# EasyEDA Pro project ProPrj_胡博睿-8777947A-分贝检测仪_2025-12-19.epro

# Schematic 分贝检测仪_SCH
Board Name: 分贝检测仪; Create Date: 2025-08-09; Page Name: P1; Project Name: 胡博睿-8777947A-分贝检测仪; Schematic Name: 分贝检测仪_SCH; Update Date: 2025-08-09; Company: 嘉立创EDA; Page Size: A4; Version: V1.0
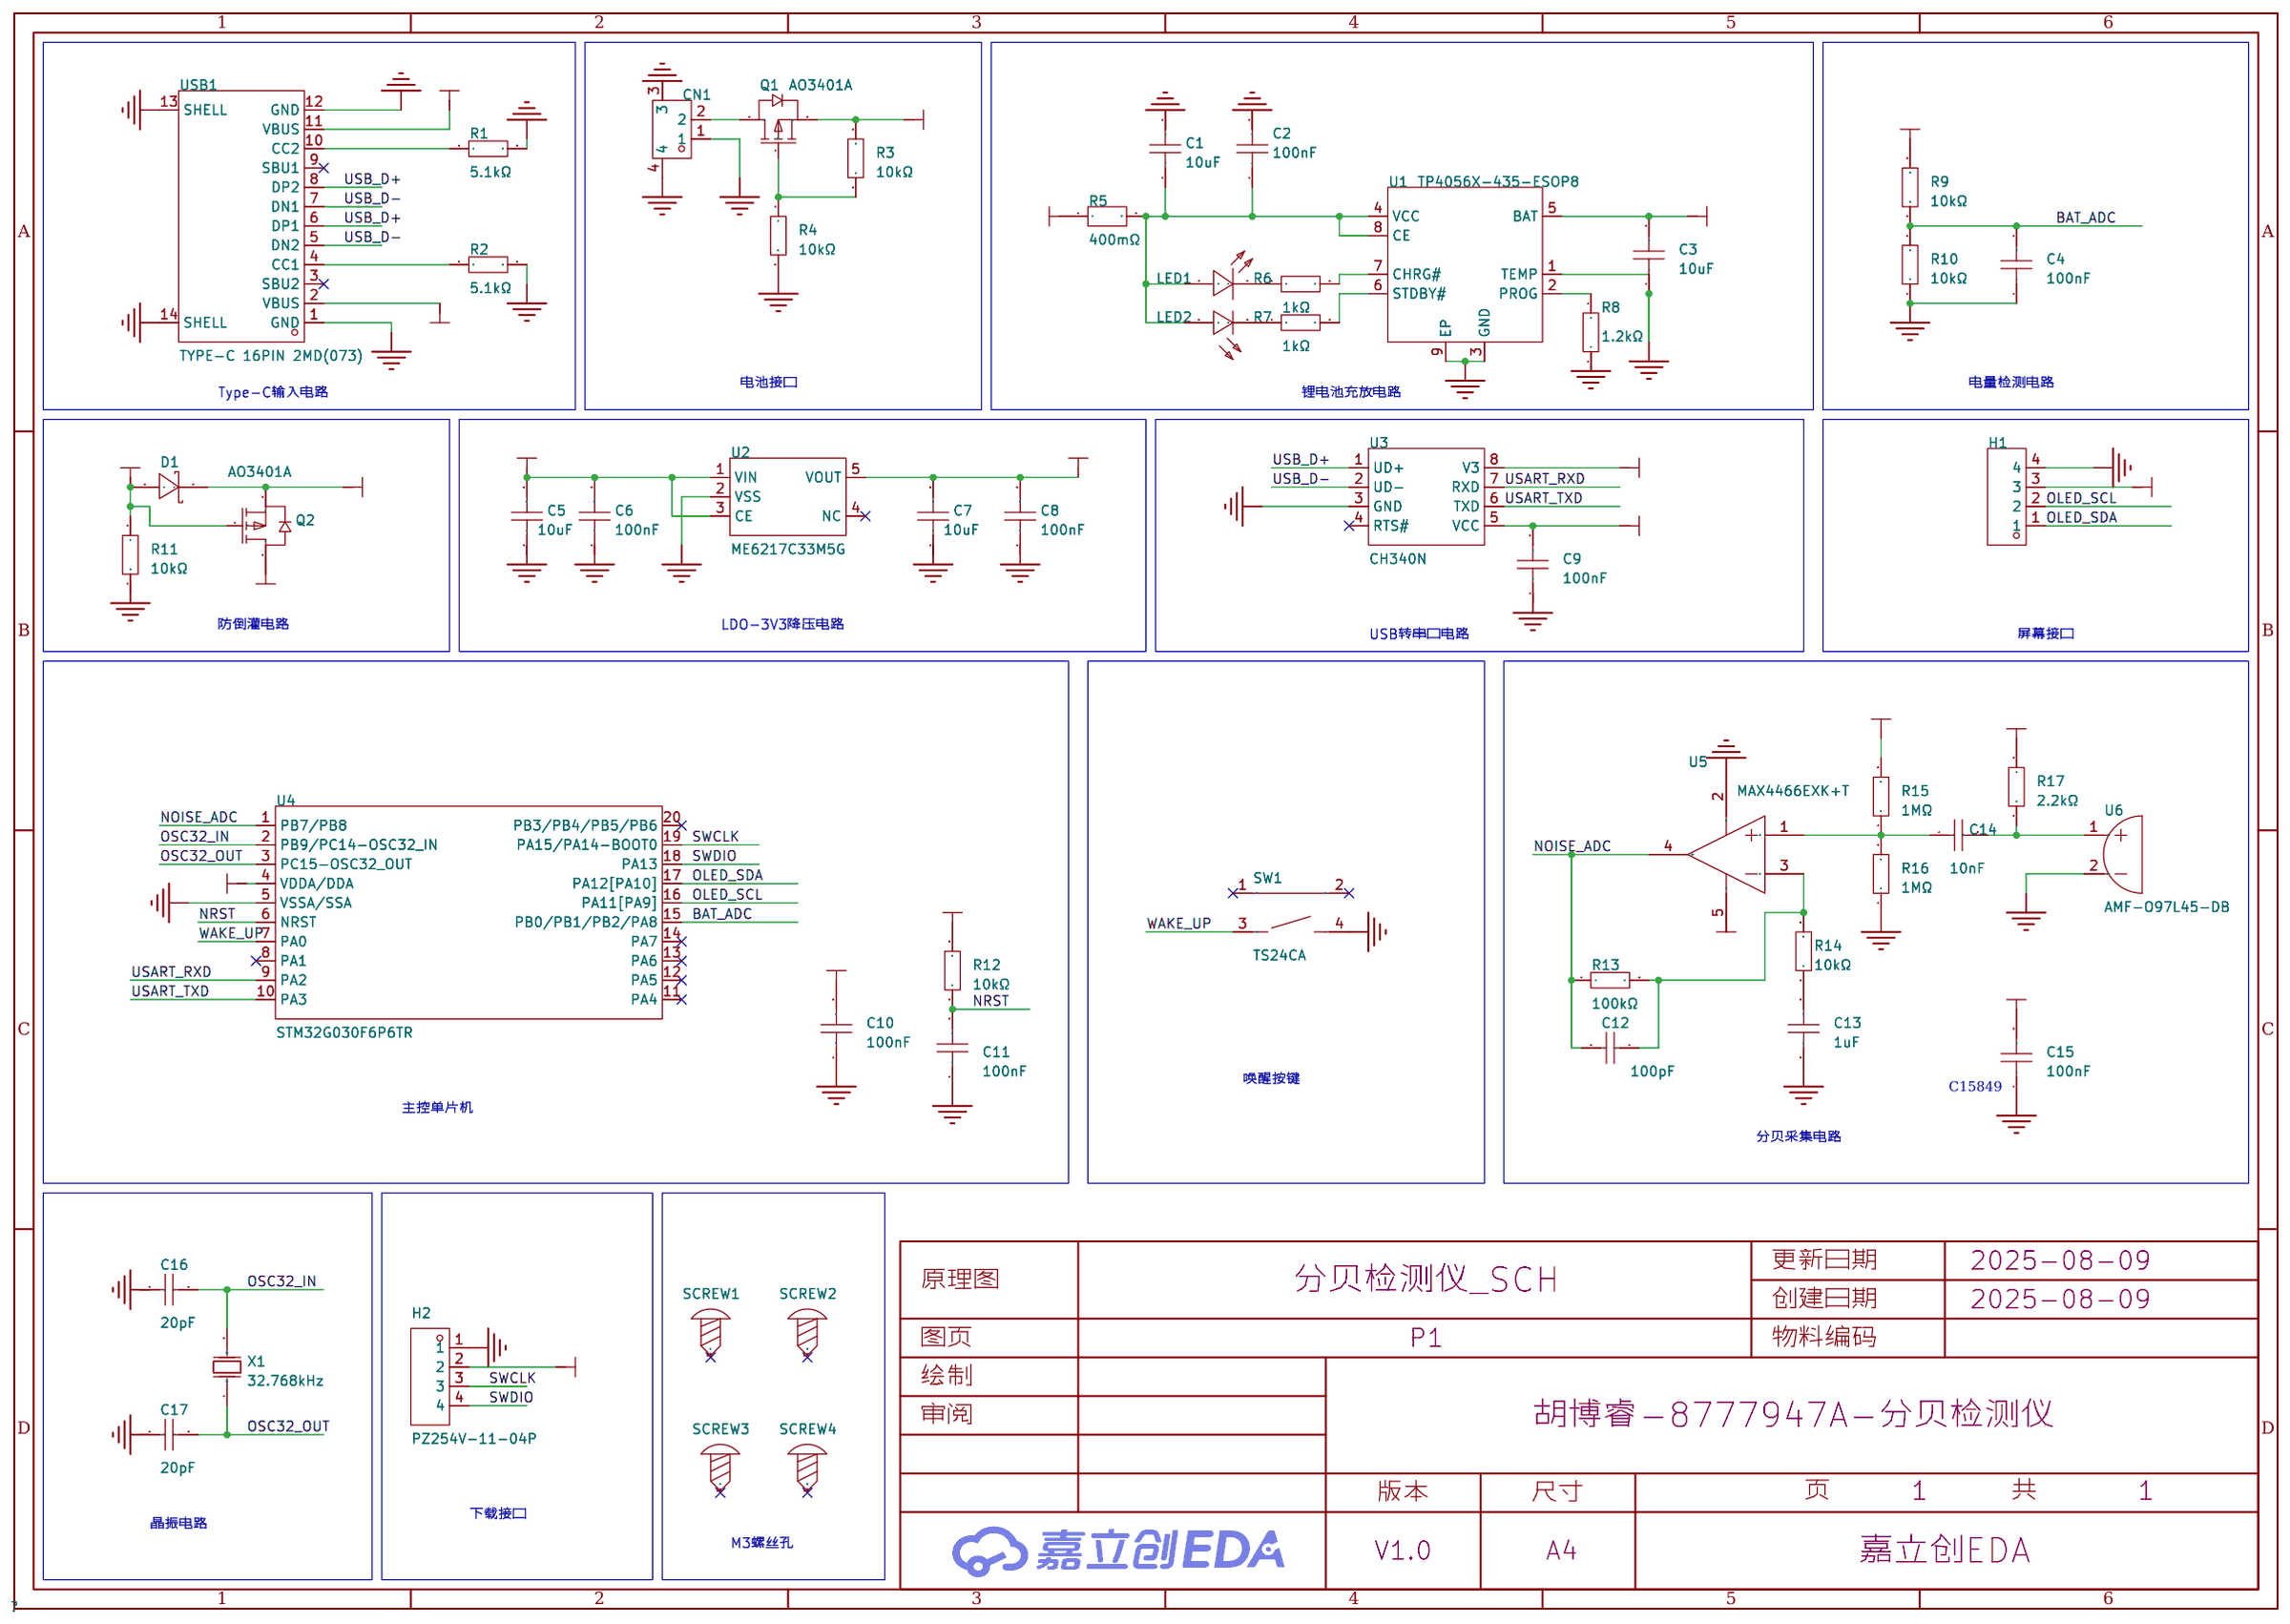
[diagram p0: schematic sheet]

## Parts
C1  10uF  [C0805]
C2  100nF  [C0603]
C3  10uF  [C0805]
C4  100nF  [C0603]
C5  10uF  [C0805]
C6  100nF  [C0603]
C7  10uF  [C0805]
C8  100nF  [C0603]
C9  100nF  [C0603]
C10  100nF  [C0603]
C11  100nF  [C0603]
C12  100pF  [C0603]
C13  1uF  [C0603]
C14  10nF  [C0603]
C15  100nF  [C0603]
C16  20pF  [C0603]
C17  20pF  [C0603]
CN1  WAFER-254W-2A  [CONN-SMD_2P-L10.0-W7.8-P2.5]
D1  1N5819WS  [SOD-323_L1.8-W1.3-LS2.5-RD]
H1  2.54-1*4P母  [HDR-TH_4P-P2.54-V-F]
H2  PZ254V-11-04P  [HDR-TH_4P-P2.54-V-M]
LED1  KT-0603R  [LED0603-RD]
LED2  NCD0603G1  [LED0603-RD_1]
Q1  AO3401A  [SOT-23_L2.9-W1.3-P1.90-LS2.4-BR]
Q2  AO3401A  [SOT-23_L2.9-W1.3-P1.90-LS2.4-BR]
R1  5.1kΩ  [R0603]
R2  5.1kΩ  [R0603]
R3  10kΩ  [R0603]
R4  10kΩ  [R0603]
R5  400mΩ  [R1206]
R6  1kΩ  [R0603]
R7  1kΩ  [R0603]
R8  1.2kΩ  [R0603]
R9  10kΩ  [R0603]
R10  10kΩ  [R0603]
R11  10kΩ  [R0603]
R12  10kΩ  [R0603]
R13  100kΩ  [R0603]
R14  10kΩ  [R0603]
R15  1MΩ  [R0603]
R16  1MΩ  [R0603]
R17  2.2kΩ  [R0603]
SCREW1  -  [M3螺丝]
SCREW2  -  [M3螺丝]
SCREW3  -  [M3螺丝]
SCREW4  -  [M3螺丝]
SW1  TS24CA  [SW-SMD_TS24CA]
U1  TP4056X-435-ESOP8  [ESOP-8_L4.9-W3.9-P1.27-LS6.0-BL-EP]
U2  ME6217C33M5G  [SOT-23-5_L3.0-W1.7-P0.95-LS2.8-BR]
U3  CH340N  [SOP-8_L4.9-W3.9-P1.27-LS6.0-BL]
U4  STM32G030F6P6TR  [TSSOP-20_L6.5-W4.4-P0.65-LS6.4-BL]
U5  MAX4466EXK+T  [SC-70-5_L2.0-W1.3-P0.65-LS2.1-BR]
U6  AMF-O97L45-DB  [MIC-TH_BD9.7-P2.50-D0.8-L-FD]
USB1  TYPE-C 16PIN 2MD(073)  [USB-C-SMD_TYPE-C-6PIN-2MD-073]
X1  32.768kHz  [CRYSTAL-SMD_L3.2-W1.5-1]

## Library data of the parts
C1 C3 C5 C7 = CL21A106KAYNNNE_C15850: 容值:10uF;精度:±10%;额定电压:25V;材质(温度系数):X5R;; LCSC Part Name: 10uF ±10% 25V; Supplier Part: C15850; Manufacturer: SAMSUNG(三星); Manufacturer Part: CL21A106KAYNNNE; Supplier Footprint: 0805; JLCPCB Part Class: 基础库; Datasheet: https://atta.szlcsc.com/upload/public/pdf/source/20160218/1457707763339.pdf; Supplier: LCSC; Tolerance: ±10%; Voltage Rated: 25V; Temperature Coefficient: X5R
C2 C4 C6 C8-C11 C15 = CC0603KRX7R9BB104: 容值:100nF;精度:±10%;额定电压:50V;温度系数:X7R;; LCSC Part Name: 100nF ±10% 50V; Supplier Part: C14663; Manufacturer: YAGEO(国巨); Supplier Footprint: 0603; JLCPCB Part Class: 基础库; Datasheet: https://atta.szlcsc.com/upload/public/pdf/source/20250214/096C4C206003071F5D32E5F0D8E7F8DF.pdf; Supplier: LCSC; Tolerance: ±10%; Voltage Rating: 50V; Temperature Coefficient: X7R
C12 = CL10C101JB8NNNC: 容值:100pF;精度:±5%;额定电压:50V;材质(温度系数):C0G;; LCSC Part Name: 100pF ±5% 50V; Supplier Part: C14858; Manufacturer: SAMSUNG(三星); Supplier Footprint: 0603; JLCPCB Part Class: 基础库; Datasheet: https://atta.szlcsc.com/upload/public/pdf/source/20160218/1457707763339.pdf; Supplier: LCSC; Tolerance: ±5%; Voltage Rated: 50V; Temperature Coefficient: C0G
C13 = CL10A105KB8NNNC: 容值:1uF;精度:±10%;额定电压:50V;材质(温度系数):X5R;; LCSC Part Name: 1uF ±10% 50V; Supplier Part: C15849; Manufacturer: SAMSUNG(三星); Supplier Footprint: 0603; JLCPCB Part Class: 基础库; Datasheet: https://atta.szlcsc.com/upload/public/pdf/source/20160218/1457707763339.pdf; Supplier: LCSC; Tolerance: ±10%; Voltage Rated: 50V; Temperature Coefficient: X5R
C14 = 0603B103K500NT: 容值:10nF;精度:±10%;额定电压:50V;温度系数:X7R;; LCSC Part Name: 10nF ±10% 50V; Supplier Part: C57112; Manufacturer: FH(风华); Supplier Footprint: 0603; JLCPCB Part Class: 基础库; Datasheet: https://atta.szlcsc.com/upload/public/pdf/source/20200305/C486355_26A10D38EF8C2A5C37091D0039909270.pdf; Supplier: LCSC; Tolerance: ±10%; Voltage Rating: 50V; Temperature Coefficient: X7R
C16 C17 = CL10C200JB8NNNC: 容值:20pF;精度:±5%;额定电压:50V;材质(温度系数):C0G;; LCSC Part Name: 20pF ±5% 50V; Supplier Part: C1648; Manufacturer: SAMSUNG(三星); Supplier Footprint: 0603; JLCPCB Part Class: 基础库; Datasheet: https://atta.szlcsc.com/upload/public/pdf/source/20160218/1457707763339.pdf; Supplier: LCSC; Tolerance: ±5%; Voltage Rated: 50V; Temperature Coefficient: C0G
CN1 = WAFER-254W-2A: 插针结构:1x2P;间距:2.54mm;安装方式:卧贴;参考系列:XH;总PIN数:2P;排数:1;每排PIN数:2;行距:-;额定电流:3A;工作温度:-25℃~+85℃;; LCSC Part Name: 1x2P 间距:2.54mm 卧贴 系列:XH; Supplier Part: C2874547; Manufacturer: HANBO(汉博); Supplier Footprint: SMD,P=2.5mm; JLCPCB Part Class: 扩展库; Datasheet: https://atta.szlcsc.com/upload/public/pdf/source/20221110/FBF8A05C070D4CF28CFC2B7FE1B270F7.pdf; Supplier: LCSC; Pins Structure: 1x2P; Pitch: 2.54mm; Mounting Type: 卧贴; Reference Series: XH; Number of Pins: 2P; Number of Rows: 1; Number of PINs Per Row: 2; Current Rating: 3A; Operating Temperature: -25℃~+85℃; Voltage Rating: 250V
D1 = 1N5819WS_C191023: 正向压降(Vf):600mV@1A;直流反向耐压(Vr):40V;整流电流:1A;; LCSC Part Name: 电压:40V 电流:1A; Supplier Part: C191023; Manufacturer: Hottech(合科泰); Supplier Footprint: SOD-323; JLCPCB Part Class: 基础库; Datasheet: https://atta.szlcsc.com/upload/public/pdf/source/20220428/3CB86FD8D28D653594B4E35F9D5AEFD9.pdf; Supplier: LCSC; Forward Voltage (Vf@If): 600mV@1A; Reverse Voltage (Vr): 40V; Rectified Current: 1A
H1 = 2.54-1*4P母: 插孔结构:1x4P;间距:2.54mm;行距:-;圆孔/方孔:方孔;安装类型:直插;排数:单排;总孔位数:4P;额定电流:3A;额定电压:-;插孔方向:顶部;塑高:-;触头材质:青铜;触头镀层:-;工作温度范围:-40℃~+105℃;焊接温度(最大值):-;; LCSC Part Name: 间距:2.54mm 1x4P 直插; Supplier Part: C2718488; Manufacturer: BOOMELE(博穆精密); Supplier Footprint: 插件,P=2.54mm; JLCPCB Part Class: 扩展库; Datasheet: https://atta.szlcsc.com/upload/public/pdf/source/20210301/C2718488_F4427B881E42CAA8DDB0B1C12B3A522C.pdf; Supplier: LCSC; Holes Structure: 1x4P; Pitch: 2.54mm; Circular Hole / Square Hole: 方孔; Mounting Type: 直插; Number of Rows: 单排; Number of Holes: 4P; Current Rating (Max): 3A; Holes Direction: 顶部; Contact Material: 青铜; Operating Temperature Range: -40℃~+105℃
H2 = PZ254V-11-04P: 插针结构:1x4P;间距:2.54mm;行距:-;圆针/方针:方针;安装类型:直插;排数:单排;总PIN位数:4P;额定电流:3A;额定电压:250V;配合针长度:6mm;塑高:2.5mm;端接针长度:3mm;触头材质:-;工作温度范围:-40℃~+105℃;颜色:黑色;; LCSC Part Name: 间距:2.54mm 1x4P 直插 方针; Supplier Part: C2691448; Manufacturer: XFCN(兴飞); Supplier Footprint: 插件,P=2.54mm; JLCPCB Part Class: 扩展库; Datasheet: https://atta.szlcsc.com/upload/public/pdf/source/20200309/C492403_F9F19131791D08044AD4F84F8E751A34.pdf; Supplier: LCSC; Pin Structure: 1x4P; Pitch: 2.54mm; Circluar Pins/Square Pins: 方针; Mounting Type: 直插; Number of Rows: 单排; Number of Pins: 4P; Current Rating (Max): 3A; Voltage Rating (Max): 250V; Length of Mating Pin: 6mm; Insulation Height: 2.5mm; Length of End Connection Pin: 3mm; Operating Temperature Range: -40℃~+105℃; Color: 黑色
LED1 = KT-0603R: 发光颜色:红色;功率:-;正向电流:-;主波长:-;二极管配置:-;透镜颜色:-;色温:-;发光角度:-;载带方式:-;工作温度:-40℃~+85℃;; LCSC Part Name: 0603 红灯 高亮; Supplier Part: C2286; Manufacturer: KENTO; Supplier Footprint: 0603; JLCPCB Part Class: 基础库; Datasheet: https://atta.szlcsc.com/upload/public/pdf/source/20160616/1466072038404.pdf; Supplier: LCSC; Emitted Color: 红色; Operating Temperature: -40℃~+85℃
LED2 = NCD0603G1: 发光颜色:翠绿色;正向压降(Vf):2.6V~3.6V;功率:72mW;正向电流:20mA;波长:515nm~530nm;透镜颜色:-;发光强度:330mcd~900mcd;发光角度:130°;工作温度:-30℃~+85℃;; Supplier Part: C84267; Manufacturer: 国星光电; Supplier Footprint: 0603; JLCPCB Part Class: 扩展库; Datasheet: https://item.szlcsc.com/datasheet/NCD0603G1/85436.html; Supplier: LCSC; Illumination Color: 翠绿色; Voltage - Forward(Vf): 2.6V~3.6V; Power(Watts): 72mW; Forward Current: 20mA; Wavelength - Dominant: 515nm~530nm; Luminous Intensity: 330mcd~900mcd; Viewing Angle: 130°; Operating Temperature: -30℃~+85℃
Q1 Q2 = AO3401A_C347476: 数量:1个P沟道;漏源电压(Vdss):30V;连续漏极电流(Id):4.2A;导通电阻(RDS(on)):50mΩ@10V;耗散功率(Pd):1.4W;阈值电压(Vgs(th)):1.3V@250uA;; LCSC Part Name: 1个P沟道 耐压:30V 电流:4.2A; Supplier Part: C347476; Manufacturer: UMW(友台半导体); Supplier Footprint: SOT-23; JLCPCB Part Class: 扩展库; Datasheet: https://atta.szlcsc.com/upload/public/pdf/source/20250624/19C0EEFA712C89E784A9E10025849464.pdf; Supplier: LCSC; Number: 1个P沟道; Drain to Source Voltage: 30V; Current - Continuous Drain(Id): 4.2A; RDS(on): 50mΩ@10V; Pd - Power Dissipation: 1.4W; Gate Threshold Voltage (Vgs(th)): 1.3V@250uA; Gate Charge(Qg): 9.4nC@4.5V; Input Capacitance(Ciss): 954pF; Reverse Transfer Capacitance (Crss@Vds): 77pF; Operating Temperature: -55℃~+150℃; Type: P沟道; Output Capacitance(Coss): 115pF
R1 R2 = 0603WAF5101T5E: 电阻类型:厚膜电阻;阻值:5.1kΩ;精度:±1%;功率:100mW;工作电压:75V;温度系数:±100ppm/℃;; LCSC Part Name: 5.1kΩ ±1% 100mW 厚膜电阻; Supplier Part: C23186; Manufacturer: UNI-ROYAL(厚声); Supplier Footprint: 0603; JLCPCB Part Class: 基础库; Datasheet: https://atta.szlcsc.com/upload/public/pdf/source/20200306/C422600_1E6D84923E4A46A82E41ADD87F860B5C.pdf; Supplier: LCSC; Type: 厚膜电阻; Tolerance: ±1%; Power(Watts): 100mW; Voltage-Supply(Max): 75V; Temperature Coefficient: ±100ppm/℃; Operating Temperature: -55℃~+155℃
R3 R4 R9-R12 R14 = 0603WAF1002T5E: 电阻类型:厚膜电阻;阻值:10kΩ;精度:±1%;功率:100mW;工作电压:75V;温度系数:±100ppm/℃;; LCSC Part Name: 厚膜电阻 10kΩ ±1% 100mW; Supplier Part: C25804; Manufacturer: UNI-ROYAL(厚声); Supplier Footprint: 0603; JLCPCB Part Class: 基础库; Datasheet: https://atta.szlcsc.com/upload/public/pdf/source/20200306/C422600_1E6D84923E4A46A82E41ADD87F860B5C.pdf; Supplier: LCSC; Type: 厚膜电阻; Tolerance: ±1%; Power(Watts): 100mW; Voltage-Supply(Max): 75V; Temperature Coefficient: ±100ppm/℃; Operating Temperature: -55℃~+155℃
R5 = FRL1206FR400TS: 电阻类型:厚膜电阻;阻值:400mΩ;精度:±1%;功率:250mW;最大工作电压:500V;温度系数:±300ppm/℃;; LCSC Part Name: 400mΩ ±1% 250mW 厚膜电阻; Supplier Part: C2907356; Manufacturer: FOJAN(富捷); Supplier Footprint: 1206; JLCPCB Part Class: 扩展库; Datasheet: https://atta.szlcsc.com/upload/public/pdf/source/20211221/925EC7D7225764EE0046F22065062C87.pdf; Supplier: LCSC; Type: 厚膜电阻; Tolerance: ±1%; Power(Watts): 250mW; Overload Voltage (Max): 500V; Temperature Coefficient: ±300ppm/℃; Operating Temperature Range: -55℃~+155℃
R6 R7 = 0603WAF1001T5E: 电阻类型:厚膜电阻;阻值:1kΩ;精度:±1%;功率:100mW;最大工作电压:75V;温度系数:±100ppm/℃;; LCSC Part Name: 1kΩ ±1% 100mW 厚膜电阻; Supplier Part: C21190; Manufacturer: UNI-ROYAL(厚声); Supplier Footprint: 0603; JLCPCB Part Class: 基础库; Datasheet: https://atta.szlcsc.com/upload/public/pdf/source/20200306/C422600_1E6D84923E4A46A82E41ADD87F860B5C.pdf; Supplier: LCSC; Type: 厚膜电阻; Tolerance: ±1%; Power(Watts): 100mW; Overload Voltage (Max): 75V; Temperature Coefficient: ±100ppm/℃; Operating Temperature Range: -55℃~+155℃
R8 = 0603WAF1201T5E: 电阻类型:厚膜电阻;阻值:1.2kΩ;精度:±1%;功率:100mW;最大工作电压:75V;温度系数:±100ppm/℃;; LCSC Part Name: 1.2kΩ ±1% 100mW 厚膜电阻; Supplier Part: C22765; Manufacturer: UNI-ROYAL(厚声); Supplier Footprint: 0603; JLCPCB Part Class: 基础库; Datasheet: https://atta.szlcsc.com/upload/public/pdf/source/20200306/C422600_1E6D84923E4A46A82E41ADD87F860B5C.pdf; Supplier: LCSC; Type: 厚膜电阻; Tolerance: ±1%; Power(Watts): 100mW; Overload Voltage (Max): 75V; Temperature Coefficient: ±100ppm/℃; Operating Temperature Range: -55℃~+155℃
R13 = 0603WAF1003T5E: 电阻类型:厚膜电阻;阻值:100kΩ;精度:±1%;功率:100mW;最大工作电压:75V;温度系数:±100ppm/℃;; LCSC Part Name: 100kΩ ±1% 100mW 厚膜电阻; Supplier Part: C25803; Manufacturer: UNI-ROYAL(厚声); Supplier Footprint: 0603; JLCPCB Part Class: 基础库; Datasheet: https://atta.szlcsc.com/upload/public/pdf/source/20200306/C422600_1E6D84923E4A46A82E41ADD87F860B5C.pdf; Supplier: LCSC; Type: 厚膜电阻; Tolerance: ±1%; Power(Watts): 100mW; Overload Voltage (Max): 75V; Temperature Coefficient: ±100ppm/℃; Operating Temperature Range: -55℃~+155℃
R15 R16 = 0603WAF1004T5E: 电阻类型:厚膜电阻;阻值:1MΩ;精度:±1%;功率:100mW;最大工作电压:75V;温度系数:±100ppm/℃;; LCSC Part Name: 1MΩ ±1% 100mW 厚膜电阻; Supplier Part: C22935; Manufacturer: UNI-ROYAL(厚声); Supplier Footprint: 0603; JLCPCB Part Class: 基础库; Datasheet: https://atta.szlcsc.com/upload/public/pdf/source/20200306/C422600_1E6D84923E4A46A82E41ADD87F860B5C.pdf; Supplier: LCSC; Type: 厚膜电阻; Tolerance: ±1%; Power(Watts): 100mW; Overload Voltage (Max): 75V; Temperature Coefficient: ±100ppm/℃; Operating Temperature Range: -55℃~+155℃
R17 = 0603WAF2201T5E: 电阻类型:厚膜电阻;阻值:2.2kΩ;精度:±1%;功率:100mW;最大工作电压:75V;温度系数:±100ppm/℃;; LCSC Part Name: 2.2kΩ ±1% 100mW 厚膜电阻; Supplier Part: C4190; Manufacturer: UNI-ROYAL(厚声); Supplier Footprint: 0603; JLCPCB Part Class: 基础库; Datasheet: https://atta.szlcsc.com/upload/public/pdf/source/20200306/C422600_1E6D84923E4A46A82E41ADD87F860B5C.pdf; Supplier: LCSC; Type: 厚膜电阻; Tolerance: ±1%; Power(Watts): 100mW; Overload Voltage (Max): 75V; Temperature Coefficient: ±100ppm/℃; Operating Temperature Range: -55℃~+155℃
SCREW1-SCREW4 = M3螺丝: Supplier Footprint: 插件
SW1 = TS24CA: 电路结构:单刀单掷;按钮形状:矩形按钮;安装方式:卧贴;开关长度:4.55mm;开关宽度:1.8mm;开关高度:3.5mm;触点电流:50mA;额定电压:12V;带灯:-;工作寿命:-;; LCSC Part Name: 4.55*1.8*3.5mm 卧贴 轻触开关; Supplier Part: C393942; Manufacturer: SHOU HAN(首韩); Supplier Footprint: SMD; JLCPCB Part Class: 扩展库; Datasheet: https://atta.szlcsc.com/upload/public/pdf/source/20240424/43D93777DD1504A9F6E2A772ABCDC7B4.pdf; Supplier: LCSC; Circuit: 单刀单掷; Actuator Style: 矩形按钮; Mounting Type: 卧贴; Length: 4.55mm; Width: 1.8mm; Switch Height: 3.5mm; Contact Current: 50mA; Voltage Rating: 12V
U1 = TP4056X-435-ESOP8: LCSC Part Name: 1A线性锂离子电池充电器; Supplier Part: C3294513; Manufacturer: TOPPOWER(南京拓微); Supplier Footprint: ESOP-8; JLCPCB Part Class: 扩展库; Datasheet: https://item.szlcsc.com/datasheet/TP4056X-435-ESOP8/3858009.html; Supplier: LCSC
U2 = ME6217C33M5G: 输出类型:固定;工作电压:6.5V;输出电压:3.3V;输出电流:800mA;电源纹波抑制比(PSRR):65dB@(1kHz);输出极性:正极;; LCSC Part Name: 输入7V 输出3.3V 800mA; Supplier Part: C427602; Manufacturer: MICRONE(南京微盟); Supplier Footprint: SOT-23-5; JLCPCB Part Class: 扩展库; Datasheet: https://atta.szlcsc.com/upload/public/pdf/source/20190910/C427602_D4B9162A2E9D9EF57C60010DFDECEF37.pdf; Supplier: LCSC; Output Type: 固定; Voltage - Supply: 6.5V; Output Voltage: 3.3V; Output Current: 800mA; Power Supply Rejection Ratio (PSRR): 65dB@(1kHz); Voltage Dropout: 180mV@(300mA); standby current: 100uA; Features: 过热保护；带使能; Operating Temperature: -40℃~+85℃; Output Configuration: 正极; Number of Outputs: 1
U3 = CH340N: 应用功能:USB转串口;接口协议:USB 2.0;通道数:1;数据速率:2Mbps;; LCSC Part Name: USB2.0芯片CH340; Supplier Part: C2977777; Manufacturer: WCH(南京沁恒); Supplier Footprint: SOP-8; JLCPCB Part Class: 扩展库; Datasheet: https://atta.szlcsc.com/upload/public/pdf/source/20240313/115CDE92081B1D6CB446704AD5D0F5F2.pdf; Supplier: LCSC; Applications Function: USB转串口; Protocol: USB 2.0; Number of Channels: 1; Voltage - Supply: 3.3V；5V; Data Rate: 2Mbps; Operating Temperature: -20℃~+70℃
U4 = STM32G030F6P6TR: CPU内核:-;CPU最大主频:64MHz;; LCSC Part Name: 主流超值系列Arm Cortex-M0+ MCU，具有32 KB Flash存储器、8 KB RAM、64 MHz CPU、2x USART、定时器、ADC和通信接口，2-3.6V; Supplier Part: C529330; Manufacturer: ST(意法半导体); Supplier Footprint: TSSOP-20; JLCPCB Part Class: 扩展库; Datasheet: https://item.szlcsc.com/datasheet/STM32G030F6P6TR/549608.html; Supplier: LCSC; CPU Maximum Speed: 64MHz; Program Storage Size: 32KB; Program Memory Type: FLASH; Number of I/O: 17; ADC (Bit): 12bit; Voltage - Supply: 2V~3.6V
U5 = MAX4466EXK+T: 功放类型:-;扬声器通道数:单声道;输出功率:-;静态电流(Iq):-;; LCSC Part Name: 低成本、微功耗、SC70/SOT23-8封装、麦克风前置放大器，可完全关断; Supplier Part: C7456762; Manufacturer: ADI(亚德诺)/MAXIM(美信); Supplier Footprint: SC-70-5; JLCPCB Part Class: 扩展库; Datasheet: https://atta.szlcsc.com/upload/public/pdf/source/20230919/1C26F795883D5A758FE0EDB1A75C39BE.pdf; Supplier: LCSC; Speaker Channels: 单声道; Voltage - Supply: 2.4V~5.5V; Operating Temperature: -40℃~+85℃
U6 = AMF-O97L45-DB: 指向性:全指向;输出阻抗:2.2kΩ;信噪比:58dB;灵敏度:-45dB@±3dB;; LCSC Part Name: 麦克风; Supplier Part: C20200114; Manufacturer: Dragonstate(华龙); Supplier Footprint: 插件,D=9.7mm; JLCPCB Part Class: 扩展库; Datasheet: https://atta.szlcsc.com/upload/public/pdf/source/20231229/9F723EEB5B11CF25645C0A921348009B.pdf; Supplier: LCSC; Voltage - Supply: 3V; Current - Supply: 500uA; Direction: 全指向; Output Impedance: 2.2kΩ; S/N Ratio: 58dB; Sensitivity: -45dB@±3dB
USB1 = TYPE-C 16PIN 2MD(073): 连接器类型:Type-C;协议标准:USB 3.1;公母:母;安装方式:卧贴;触点数量:16P;端口数量:1;额定电流 - 电源:3A;工作温度:-25℃~+85℃;; LCSC Part Name: Type-C 母 卧贴; Supplier Part: C2765186; Manufacturer: SHOU HAN(首韩); Supplier Footprint: SMD; JLCPCB Part Class: 扩展库; Datasheet: https://item.szlcsc.com/datasheet/TYPE-C%252016PIN%25202MD(073)/2901843.html; Supplier: LCSC; Connector Type: Type-C; Protocol Standard: USB 3.1; Gender: 母; Mounting Type: 卧贴; Number of Contacts: 16P; Number of Ports: 1; Current Rating-Power: 3A; Voltage Rating: 5V; Connect-Disconnect Life: 5千次; Detection color: 黑色; Operating Temperature: -25℃~+85℃
X1 = XKXGI-SUA-32.768K: 晶振类型:贴片晶振;频率:32.768kHz;常温频差:±20ppm;负载电容:12.5pF;频率稳定度:±30ppm;; LCSC Part Name: YST310S 32.768KHZ 2P 3215 12.5PF ±20PPM -40~85℃; Supplier Part: C5213671; Manufacturer: YXC(扬兴晶振); Supplier Footprint: SMD3215-2P; JLCPCB Part Class: 扩展库; Datasheet: https://atta.szlcsc.com/upload/public/pdf/source/20240329/3A7650FD985DD0DE85694D3785AB4916.pdf; Supplier: LCSC; Type: 贴片晶振; Normal temperature Frequency Tolerance: ±20ppm; Load Capacitance: 12.5pF; Frequency Stability: ±30ppm; Operating Temperature: -40℃~+85℃

## Nets
+3V3: C7.2 C8.2 C9.2 C10.2 C15.2 H1.3 H2.2 R12.2 R15.2 R17.2 U2.5(VOUT) U3.5(VCC) U3.8(V3) U4.4(VDDA/DDA) U5.5(VCC)
GND: C1.2 C2.2 C3.1 C4.1 C5.1 C6.1 C7.1 C8.1 C9.1 C10.1 C11.1 C13.1 C15.1 C16.1 C17.1 CN1.1 CN1.3 CN1.4 H1.4 H2.1 R1.2 R2.2 R4.2 R8.1 R10.1 R11.1 R16.1 SW1.4 U1.1(TEMP) U1.3(GND) U1.9(EP) U2.2(VSS) U3.3(GND) U4.5(VSSA/SSA) U5.2(GND) U6.2 USB1.1(GND) USB1.12(GND) USB1.13(SHELL) USB1.14(SHELL)
VBUS: D1.2(A) Q2.1(G) R5.1 R11.2 USB1.2(VBUS) USB1.11(VBUS)
VIN: C5.2 C6.2 D1.1(K) Q2.2(S) U2.1(VIN) U2.3(CE)
BAT+: C3.2 Q1.2(S) Q2.3(D) R3.2 R9.2 U1.5(BAT)
BAT_ADC: C4.2 R9.1 R10.2 U4.15(PB0/PB1/PB2/PA8)
NOISE_ADC: C12.2 R13.1 U4.1(PB7/PB8) U5.4(OUT)
NRST: C11.2 R12.1 U4.6(NRST)
OLED_SCL: H1.2 U4.16(PA11[PA9])
OLED_SDA: H1.1 U4.17(PA12[PA10])
OSC32_IN: C16.2 U4.2(PB9/PC14-OSC32_IN) X1.2(OSC2)
OSC32_OUT: C17.2 U4.3(PC15-OSC32_OUT) X1.1(OSC1)
SWCLK: H2.3 U4.19(PA15/PA14-BOOT0)
SWDIO: H2.4 U4.18(PA13)
USART_RXD: U3.7(RXD) U4.9(PA2)
USART_TXD: U3.6(TXD) U4.10(PA3)
USB_D+: U3.1(UD+) USB1.6(DP1) USB1.8(DP2)
USB_D-: U3.2(UD-) USB1.5(DN2) USB1.7(DN1)
WAKE_UP: SW1.3 U4.7(PA0)
$1N454: R1.1 USB1.10(CC2)
$1N567: R2.1 USB1.4(CC1)
$1N871: CN1.2 Q1.3(D)
$1N1036: Q1.1(G) R3.1 R4.1
$1N1657: C1.1 C2.1 LED1.2(A) LED2.2(A) R5.2 U1.4(VCC) U1.8(CE)
$1N2255: LED1.1(K) R6.1
$1N2294: LED2.1(K) R7.1
$1N2335: R6.2 U1.7(CHRG#)
$1N2340: R7.2 U1.6(STDBY#)
$1N2532: R8.2 U1.2(PROG)
$1N5498: C12.1 R13.2 R14.2 U5.3(IN-)
$1N5748: C13.2 R14.1
$1N6100: C14.1 R15.1 R16.2 U5.1(IN+)
$1N6105: C14.2 R17.1 U6.1

Not connected (* = marked no-connect by the designer): SCREW1 1*; SCREW2 1*; SCREW3 1*; SCREW4 1*; SW1 1* 2*; U2 4(NC)*; U3 4(RTS#)*; U4 8(PA1)* 11(PA4)* 12(PA5)* 13(PA6)* 14(PA7)* 20(PB3/PB4/PB5/PB6)*; USB1 3(SBU2)* 9(SBU1)*

## Notes on the sheet
- Type-C输入电路
- 电池接口
- 锂电池充放电路
- 电量检测电路
- 防倒灌电路
- LDO-3V3降压电路
- USB转串口电路
- 屏幕接口
- 唤醒按键
- C15849
- 主控单片机
- 分贝采集电路
- 晶振电路
- 下载接口
- M3螺丝孔

# Board 分贝检测仪_PCB
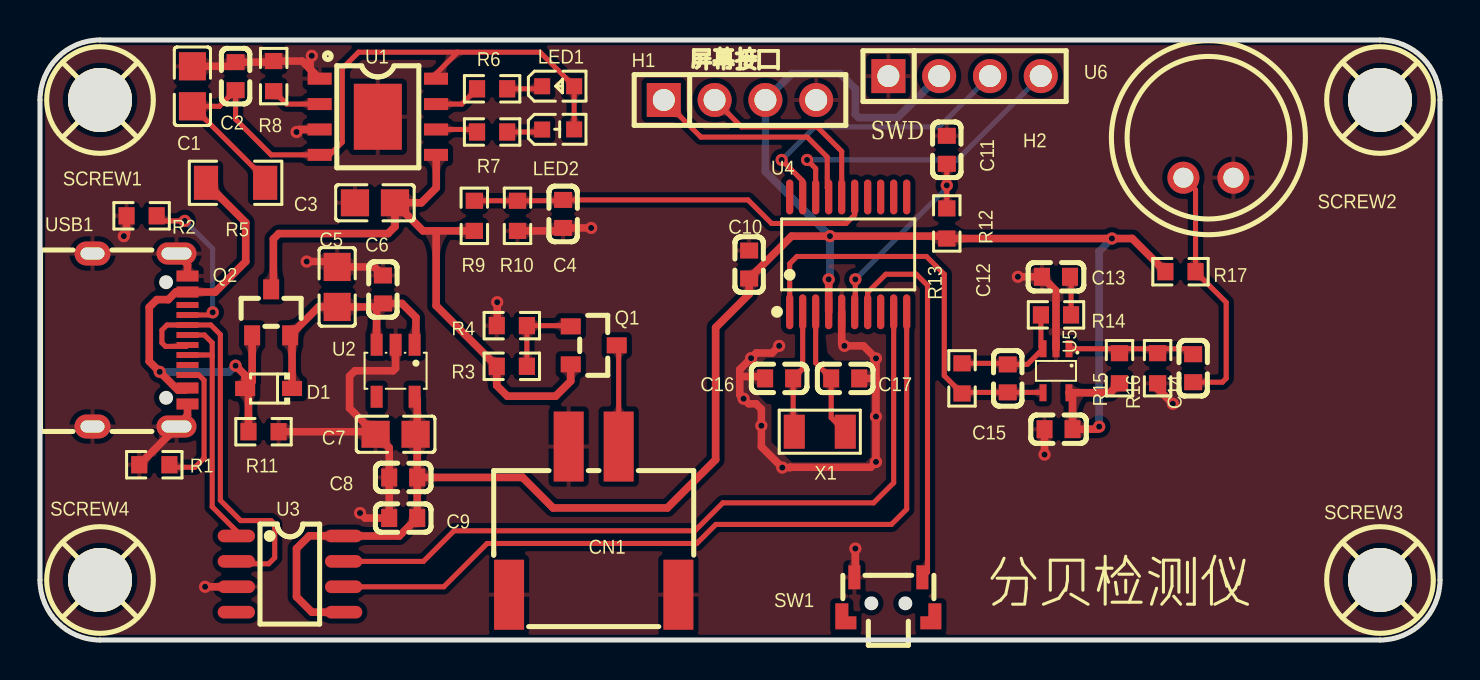
[diagram p1: board, top side]
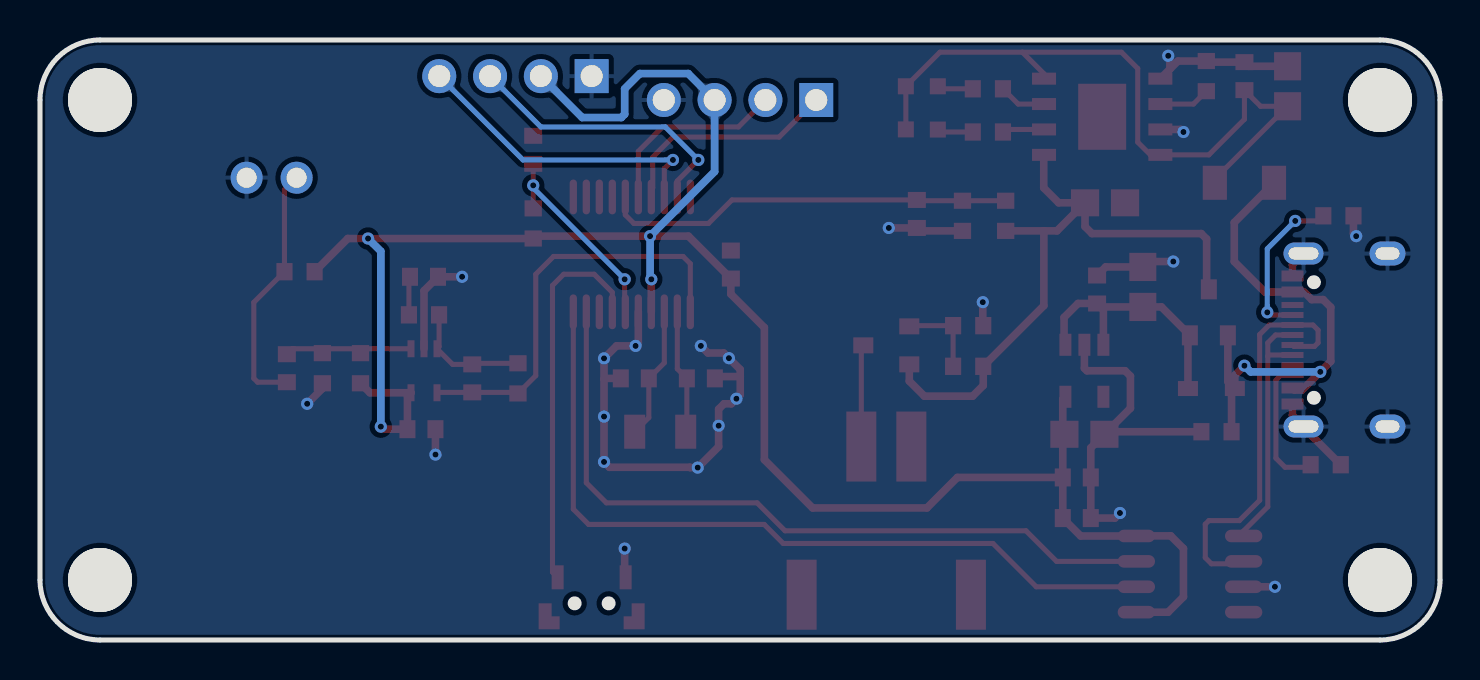
[diagram p2: board, bottom side, seen from below]

Outline 70 x 30 mm; copper layers: Top Layer, Bottom Layer. Coordinates in mm from the lower left corner of the outline.
Outline path: 0,27 0,3 arc(0.88,0.88) 3,0 67,0 arc(69.12,0.88) 70,3 70,27 arc(69.12,29.12) 67,30 3,30 arc(0.88,29.12) 0,27
Stack: Top Layer 0.035mm / Dielectric1 1.51mm FR4 er 4.5 / Bottom Layer 0.035mm

## Design rules (mm)
template: 自定义配置
spacing copperThickness1oz (default): track to track 0.152, other pairs 0.152 to 0.3
spacing copperThickness2oz: track to track 0.152, other pairs 0.152 to 0.3
track width copperThickness1oz (default): min 0.254, default 0.254, max 0.254
track width copperThickness2oz: min 0.203, default 0.254, max 2.54
track width PWR: min 0.254, default 0.381, max 2.54
differential pair differentialPair (default): width min 0.127, default 0.254, max 2.54; gap min 0.152, default 0.152
via viaSize (default): diameter min 0.61, default 0.61, max 0.61; hole min 0.305, default 0.305, max 0.305
net GND uses PWR
net BAT+ uses PWR
net VIN uses PWR
net +3V3 uses PWR
net VBUS uses PWR

## Placement (name value [footprint] x y rotation side)
C1  10uF  [C0805]  7.62 27.69 90 top
C2  100nF  [C0603]  9.78 28.19 90 top
C3  10uF  [C0805]  16.75 21.86 0 top
C4  100nF  [C0603]  26.16 21.3 90 top
C5  10uF  [C0805]  14.86 17.65 270 top
C6  100nF  [C0603]  17.14 17.53 270 top
C7  10uF  [C0805]  17.78 10.29 0 top
C8  100nF  [C0603]  18.16 8.13 0 top
C9  100nF  [C0603]  18.16 6.1 0 top
C10  100nF  [C0603]  35.46 18.77 270 top
C11  100nF  [C0603]  45.34 24.51 270 top
C12  100pF  [C0603]  48.39 13.08 270 top
C13  1uF  [C0603]  50.8 18.16 0 top
C14  10nF  [C0603]  57.66 13.59 270 top
C15  100nF  [C0603]  50.93 10.54 0 top
C16  20pF  [C0603]  36.96 13.08 0 top
C17  20pF  [C0603]  40.26 13.08 180 top
CN1  WAFER-254W-2A  [CONN-SMD_2P-L10.0-W7.8-P2.5]  27.69 5.97 0 top
D1  1N5819WS  [SOD-323_L1.8-W1.3-LS2.5-RD]  11.43 12.57 180 top
H1  2.54-1*4P母  [HDR-TH_4P-P2.54-V-F]  35 27 0 top
H2  PZ254V-11-04P  [HDR-TH_4P-P2.54-V-M]  46.23 28.19 0 top
LED1  KT-0603R  [LED0603-RD]  25.91 27.69 0 top
LED2  NCD0603G1  [LED0603-RD_1]  25.91 25.53 0 top
Q1  AO3401A  [SOT-23_L2.9-W1.3-P1.90-LS2.4-BR]  27.69 14.73 180 top
Q2  AO3401A  [SOT-23_L2.9-W1.3-P1.90-LS2.4-BR]  11.56 16.38 270 top
R1  5.1kΩ  [R0603]  5.72 8.76 180 top
R2  5.1kΩ  [R0603]  5.08 21.21 180 top
R3  10kΩ  [R0603]  23.59 13.69 180 top
R4  10kΩ  [R0603]  23.59 15.72 180 top
R5  400mΩ  [R1206]  9.78 22.86 0 top
R6  1kΩ  [R0603]  22.61 27.56 180 top
R7  1kΩ  [R0603]  22.61 25.4 180 top
R8  1.2kΩ  [R0603]  11.68 28.19 270 top
R9  10kΩ  [R0603]  21.72 21.21 270 top
R10  10kΩ  [R0603]  23.88 21.21 90 top
R11  10kΩ  [R0603]  11.18 10.41 180 top
R12  10kΩ  [R0603]  45.34 20.83 270 top
R13  100kΩ  [R0603]  46.1 13.08 90 top
R14  10kΩ  [R0603]  50.8 16.26 180 top
R15  1MΩ  [R0603]  53.97 13.59 270 top
R16  1MΩ  [R0603]  55.88 13.59 90 top
R17  2.2kΩ  [R0603]  57.02 18.42 180 top
SCREW1  -  [M3螺丝]  3 27 0 top
SCREW2  -  [M3螺丝]  67 27 0 top
SCREW3  -  [M3螺丝]  67 3 0 top
SCREW4  -  [M3螺丝]  3 3 0 top
SW1  TS24CA  [SW-SMD_TS24CA]  42.42 2.16 180 top
U1  TP4056X-435-ESOP8  [ESOP-8_L4.9-W3.9-P1.27-LS6.0-BL-EP]  16.89 26.16 270 top
U2  ME6217C33M5G  [SOT-23-5_L3.0-W1.7-P0.95-LS2.8-BR]  17.78 13.46 90 top
U3  CH340N  [SOP-8_L4.9-W3.9-P1.27-LS6.0-BL]  12.5 3.3 270 top
U4  STM32G030F6P6TR  [TSSOP-20_L6.5-W4.4-P0.65-LS6.4-BL]  40.41 19.28 0 top
U5  MAX4466EXK+T  [SC-70-5_L2.0-W1.3-P0.65-LS2.1-BR]  50.8 13.46 90 top
U6  AMF-O97L45-DB  [MIC-TH_BD9.7-P2.50-D0.8-L-FD]  58.42 23.11 0 top
USB1  TYPE-C 16PIN 2MD(073)  [USB-C-SMD_TYPE-C-6PIN-2MD-073]  5 15 270 top
X1  32.768kHz  [CRYSTAL-SMD_L3.2-W1.5-1]  38.99 10.41 180 top

## Footprints (pads in the part's own frame, mm; a bottom-side part is the same pattern mirrored in y, then rotated)
C0603
  rect 0.8x0.9 smd: 1(-0.7,0) 2(0.7,0)
C0805
  rect 1.41x1.35 smd: 1(-1,0) 2(1,0)
CONN-SMD_2P-L10.0-W7.8-P2.5
  rect 1.5x3.5 smd: 1(-1.253,3.704) 2(1.248,3.704) 3(4.232,-3.704) 4(-4.232,-3.704)
CRYSTAL-SMD_L3.2-W1.5-1
  rect 1.05x1.7 smd: 1(-1.275,0) 2(1.275,0)
ESOP-8_L4.9-W3.9-P1.27-LS6.0-BL-EP
  rect 0.6x1.2 smd: 1(-1.905,-2.909) 2(-0.635,-2.909) 3(0.635,-2.909) 4(1.905,-2.909) 5(1.905,2.909) 6(0.635,2.909) 7(-0.635,2.909) 8(-1.905,2.909)
  rect 3.3x2.4 smd: 9(0,0)
HDR-TH_4P-P2.54-V-F
  rect 1.7x1.7 hole 1.1: 1(-3.81,0)
  round 1.7 hole 1.1: 2(-1.27,0) 3(1.27,0) 4(3.81,0)
HDR-TH_4P-P2.54-V-M
  rect 1.7x1.7 hole 1.1: 1(-3.81,0)
  round 1.7 hole 1.1: 2(-1.27,0) 3(1.27,0) 4(3.81,0)
LED0603-RD
  rect 0.8x0.8 smd: 1(-0.799,0) 2(0.799,0)
LED0603-RD_1
  rect 0.8x0.8 smd: 1(-0.799,-0.004) 2(0.799,0.004)
M3螺丝
  round 3.2 hole 3.2: 1(0,0)
MIC-TH_BD9.7-P2.50-D0.8-L-FD
  round 1.6 hole 1: 1(-1.25,0) 2(1.25,0)
R0603
  rect 0.806x0.864 smd: 1(-0.753,0) 2(0.753,0)
R1206
  rect 1.208x1.701 smd: 1(-1.479,0) 2(1.479,0)
SC-70-5_L2.0-W1.3-P0.65-LS2.1-BR
  rect 0.85x0.35 smd: 1(1.1,-0.65) 2(1.1,0) 3(1.1,0.65) 4(-1.1,0.65) 5(-1.1,-0.65)
SOD-323_L1.8-W1.3-LS2.5-RD
  rect 1x0.75 smd: 1(-1.173,0) 2(1.173,0)
SOP-8_L4.9-W3.9-P1.27-LS6.0-BL
  oval 0.63x1.865 smd: 1(-1.905,-2.683) 2(-0.635,-2.683) 3(0.635,-2.683) 4(1.905,-2.683) 5(1.905,2.683) 6(0.635,2.683) 7(-0.635,2.683) 8(-1.905,2.683)
SOT-23-5_L3.0-W1.7-P0.95-LS2.8-BR
  rect 1.1x0.6 smd: 1(1.3,-0.95) 2(1.3,0) 3(1.3,0.95) 4(-1.3,0.95) 5(-1.3,-0.95)
SOT-23_L2.9-W1.3-P1.90-LS2.4-BR
  rect 1x0.8 smd: 1(1.15,-0.95) 2(1.15,0.95) 3(-1.15,0)
SW-SMD_TS24CA
  custom 1.05x1.3 smd: 1(-2.125,0.975) 2(2.125,0.975)
  rect 0.6x1.2 smd: 3(-1.7,-0.975) 4(1.7,-0.975)
TSSOP-20_L6.5-W4.4-P0.65-LS6.4-BL
  oval 0.364x1.742 smd: 1(-2.925,-2.871) 2(-2.275,-2.871) 3(-1.625,-2.871) 4(-0.975,-2.871) 5(-0.325,-2.871) 6(0.325,-2.871) 7(0.975,-2.871) 8(1.625,-2.871) 9(2.275,-2.871) 10(2.925,-2.871) 11(2.925,2.871) 12(2.275,2.871) 13(1.625,2.871) 14(0.975,2.871) 15(0.325,2.871) 16(-0.325,2.871) 17(-0.975,2.871) 18(-1.625,2.871) 19(-2.275,2.871) 20(-2.925,2.871)
USB-C-SMD_TYPE-C-6PIN-2MD-073
  rect 0.55x1.1 smd: 1(-3.2,2.375) 2(-2.4,2.375) 11(2.4,2.375) 12(3.2,2.375)
  rect 0.3x1.1 smd: 3(-1.75,2.375) 4(-1.25,2.375) 5(-0.75,2.375) 6(-0.25,2.375) 7(0.25,2.375) 8(0.75,2.375) 9(1.25,2.375) 10(1.75,2.375)
  oval 1.1x2 hole 0.6x1.5: 13(-4.325,1.825) 14(4.325,1.825)
  oval 1.2x1.8 hole 0.6x1.2: 13(-4.325,-2.375) 14(4.325,-2.375)

## Nets
As in the schematic.

Pads without a net: SCREW1 1; SCREW2 1; SCREW3 1; SCREW4 1; SW1 1 2; U2 4; U3 4; U4 8 11 12 13 14 20; USB1 3 9

## Via types
v1: diameter 0.61, hole 0.305, Top Layer to Bottom Layer, 33 vias

## Routing (per net, layer and track width the routed paths; a pad name or vN(x,y) marks a point on that pad's centre or on a via; arc(x,y) is an arc through that point)
+3V3: length 106
  Top Layer w0.381: R15.2 53.5,12.36 U5.5 51.63,12.19 51.63,10.54 52.83,10.54 v1(52.96,10.67) ; U2.5 18.86,12.03 C8.2 ; U3.5 13.59,1.39 12.83,2.16 12.83,4.57 13.46,5.21 15.18,5.21 15.18,5.2 17.97,5.2 C9.2 C8.2 ; U4.4 v1(39.43,18.03) ; R17.2 54.61,20.07 v1(53.6,20.07) R12.2 45.22,20.19 v1(39.5,20.19) 37.58,20.19 C10.2 35.46,17.3 33.78,15.62 33.78,9.02 31.37,6.6 25.65,6.6 24.13,8.13 C8.2
  Bottom Layer w0.381: v1(39.43,18.03) 39.5,18.1 v1(39.5,20.19) 36.27,23.42 H1.3 37.59,28.32 40,28.32 40.77,27.56 40.77,26.29 40.93,26.12 42.89,26.12 H2.2 ; v1(53.6,20.07) 52.96,19.44 v1(52.96,10.67)
GND: length 77
  Top Layer w0.381: 34.99,13.17 34.99,12.26 35.43,11.81 35.8,11.81 36.07,11.54 v1(36.07,10.72) 36.07,9.67 v1(37.12,8.62) 37.5,8.62 37.51,8.64 41.53,8.64 v1(41.8,8.91) v1(41.8,11.17) 41.8,13.04 ; 34.99,13.17 36.17,13.17 C16.1 ; 34.99,13.17 34.99,13.53 v1(35.56,14.09) 35.81,14.35 36.6,14.35 v1(36.96,14.71) ; 41.8,13.04 v1(41.8,14.08) 41.17,14.71 v1(40.22,14.71) 40.08,14.84 U4.5 ; 41.8,13.04 41.76,13.08 40.96,13.08 ; U3.3 v1(8.25,2.66) ; v1(48.9,18.16) C13.1 50.8,17.46 U5.2 ; R10.1 26.01,20.46 C4.1 v1(27.56,20.6) ; USB1.12 7.38,11.22 USB1.14 6.83,10.63 R1.2 ; C15.1 v1(50.23,9.27) ; v1(56.64,11.81) 55.88,12.57 R16.1 ; v1(13.59,29.21) 13.51,29.13 13.51,28.54 ; v1(12.83,25.4) 12.95,25.53 U1.3 ; SW1.4 40.77,3.18 v1(40.77,4.57) ; v1(13.33,18.92) 14.59,18.92 C5.1 16.72,18.65 C6.1 ; 16.65,10.41 C7.1 17.46,9.61 C8.1 C9.1 16.26,6.1 v1(16,6.35) ; 16.65,10.41 15.48,11.59 15.48,13.19 15.75,13.46 17.65,13.46 17.78,13.59 U2.2 ; 16.65,10.41 R11.1 ; R4.2 22.86,15.74 v1(22.86,16.89) ; R2.2 4.33,20.33 v1(4.19,20.19) ; USB1.1 7.38,18.78 USB1.13 ; C1.2 9.57,28.69 C2.2 11.63,28.89 R8.1 13.1,28.95 13.51,28.54 ; 13.51,28.54 U1.1
  vias: v1(35.18,12.06)
VBUS: length 26.1
  Top Layer w0.381: D1.2 10.26,13.24 v1(9.78,13.72) ; D1.2 10.61,12.92 Q2.1 ; D1.2 10.42,12.41 R11.2 ; USB1.11 7.28,12.5 6.89,12.5 v1(5.99,13.41) 5.46,13.93 5.46,16.64 5.84,17.02 6.41,17.02 6.79,17.4 USB1.2 8.76,17.4 10.29,18.92 10.29,20.87 R5.1
  Bottom Layer w0.381: v1(9.78,13.72) 9.47,13.41 v1(5.99,13.41)
VIN: length 13
  Top Layer w0.381: C6.2 18.1,16.83 18.8,16.13 18.8,14.83 U2.1 ; U2.3 16.83,16.51 16.97,16.65 C5.2 13.93,16.65 Q2.2 12.6,15.14 D1.1
BAT+: length 32.7
  Top Layer w0.381: C3.2 19.07,21.86 19.81,22.61 19.81,24.24 U1.5 ; C3.2 19.15,20.46 19.81,20.46 ; C3.2 17.75,20.67 17.4,20.32 11.94,20.32 11.67,20.05 11.67,17.64 Q2.3 ; 19.81,20.46 19.81,16.72 R3.2 22.84,12.72 23.37,12.19 25.78,12.19 26.54,12.95 Q1.2 ; 19.81,20.46 R9.2
BAT_ADC: length 20.6
  Top Layer w0.254: U4.15 40.73,21.26 40.31,20.83 36.58,20.83 35.4,22 C4.2 26.12,21.96 R10.2 R9.1
NOISE_ADC: length 21.1
  Top Layer w0.254: U4.1 37.48,18.82 37.85,19.18 44.32,19.18 45.21,18.29 45.21,13.22 R13.1 46.15,12.38 C12.2 50.13,12.38 U5.4
NRST: length 10.5
  Top Layer w0.254: U4.6 40.77,16.44 v1(40.77,18.03) ; C11.2 v1(45.34,22.73) R12.1
  Bottom Layer w0.254: v1(40.77,18.03) 45.34,22.61 v1(45.34,22.73)
OLED_SCL: length 9.7
  Top Layer w0.254: U4.16 40.08,24.43 38.86,25.65 35.08,25.65 H1.2
OLED_SDA: length 11.8
  Top Layer w0.254: 31.56,27.01 31.2,27.01 H1.1 33.04,25.15 38.36,25.15 39.36,24.14 39.36,22.61 39.43,22.55 39.43,22.16 U4.17
OSC32_IN: length 6.2
  Top Layer w0.254: U4.2 38.13,13.56 C16.2 37.66,10.47 X1.2
OSC32_OUT: length 6.6
  Top Layer w0.254: X1.1 39.56,11.12 C17.2 38.78,13.86 U4.3
SWCLK: length 14.4
  Top Layer w0.254: v1(37.08,24) 38.13,22.95 U4.19
  Bottom Layer w0.254: H2.3 44.96,25.65 38.74,25.65 v1(37.08,24)
SWDIO: length 15.4
  Top Layer w0.254: U4.18 38.78,23.57 v1(38.35,24)
  Bottom Layer w0.254: v1(38.35,24) 45.85,24 H2.4
USART_RXD: length 37.7
  Top Layer w0.254: U4.9 42.68,7.86 41.68,6.86 34.14,6.86 32.75,5.46 20.7,5.46 19.17,3.93 U3.7
USART_TXD: length 39.6
  Top Layer w0.254: U3.6 20.19,2.66 22.35,4.83 32.84,4.83 33.79,5.78 42.57,5.78 43.33,6.54 U4.10
USB_D+: length 12.8
  Top Layer w0.254: USB1.8 8.55,14.25 8.61,14.19 8.61,14.86 8.22,15.25 USB1.6 ; 8.61,14.19 8.61,6.66 9.82,5.45 9.82,5.2
USB_D-: length 20.5
  Top Layer w0.254: U3.2 9.94,3.81 11.43,3.81 11.74,4.12 11.74,5.79 11.56,5.97 10.03,5.97 9.02,6.98 9.02,15.27 8.54,15.75 USB1.5 6.35,15.75 6.1,15.49 6.1,14.86 6.28,14.68 7.3,14.68 USB1.7
WAKE_UP: length 19.3
  Top Layer w0.254: SW1.3 44.38,3.39 44.38,17.73 43.81,18.29 42.29,18.29 41.38,17.38 U4.7
$1N454: length 6.8
  Top Layer w0.254: USB1.10 7.94,13.25 8.2,12.99 8.2,9.09 7.75,8.64 6.6,8.64 R1.1
$1N567: length 8
  Top Layer w0.254: USB1.4 8.5,16.25 v1(8.64,16.38) ; v1(7.24,20.95) 6.09,20.95 R2.1
  Bottom Layer w0.254: v1(8.64,16.38) 8.64,19.56 v1(7.24,20.95)
$1N871: length 5.1
  Top Layer w0.254: CN1.2 28.93,14.63 Q1.3
$1N1036: length 4.2
  Top Layer w0.254: Q1.1 26.5,15.72 R4.1 R3.1
$1N1657: length 35.9
  Top Layer w0.254: 20.88,29.39 25,29.39 LED1.2 LED2.2 ; 20.88,29.39 19.8,28.31 U1.8 ; 20.88,29.39 15.93,29.39 15.11,28.58 15.11,24.89 14.48,24.26 U1.4 11.56,24.26 9.78,26.03 C2.1 8.97,26.69 C1.1 11.26,23.05 R5.2
$1N2255: length 1.8
  Top Layer w0.254: R6.1 24.98,27.56 LED1.1
$1N2294: length 1.8
  Top Layer w0.254: R7.1 24.99,25.4 LED2.1
$1N2335: length 2.4
  Top Layer w0.254: R6.2 21.09,26.8 19.8,26.8
$1N2340: length 2.1
  Top Layer w0.254: U1.6 21.73,25.53 R7.2
$1N2532: length 2.6
  Top Layer w0.254: 13.98,26.8 12.33,26.8 R8.2
$1N5498: length 6.1
  Top Layer w0.254: R13.2 48.33,13.83 C12.1 49.37,13.78 U5.3 50.05,14.67 R14.2
$1N5748: length 1.9
  Top Layer w0.254: R14.1 51.55,18.11 C13.2
$1N6100: length 6.3
  Top Layer w0.254: U5.1 57.38,14.56 C14.1
$1N6105: length 12.6
  Top Layer w0.254: C14.2 59.12,12.89 59.31,13.08 59.31,16.88 R17.1 57.78,22.51 U6.1

## Copper pours and planes (outline as drawn; the poured copper is in the pictures)
GND on Top Layer: -4.32,31.88 76.71,31.88 76.71,-3.56 -4.32,-3.56
GND on Bottom Layer: -4.95,32.77 75.56,32.77 75.56,-3.68 -4.95,-3.68

Small or netless copper shapes (teardrops, artwork), in the pictures only: 208 on Top Layer, 18 on Bottom Layer

## Text on the board
Top Silkscreen Layer: 分贝检测仪 | 屏幕接口 | SWD
